# Altium project RevvyPcbTester.PrjPcb
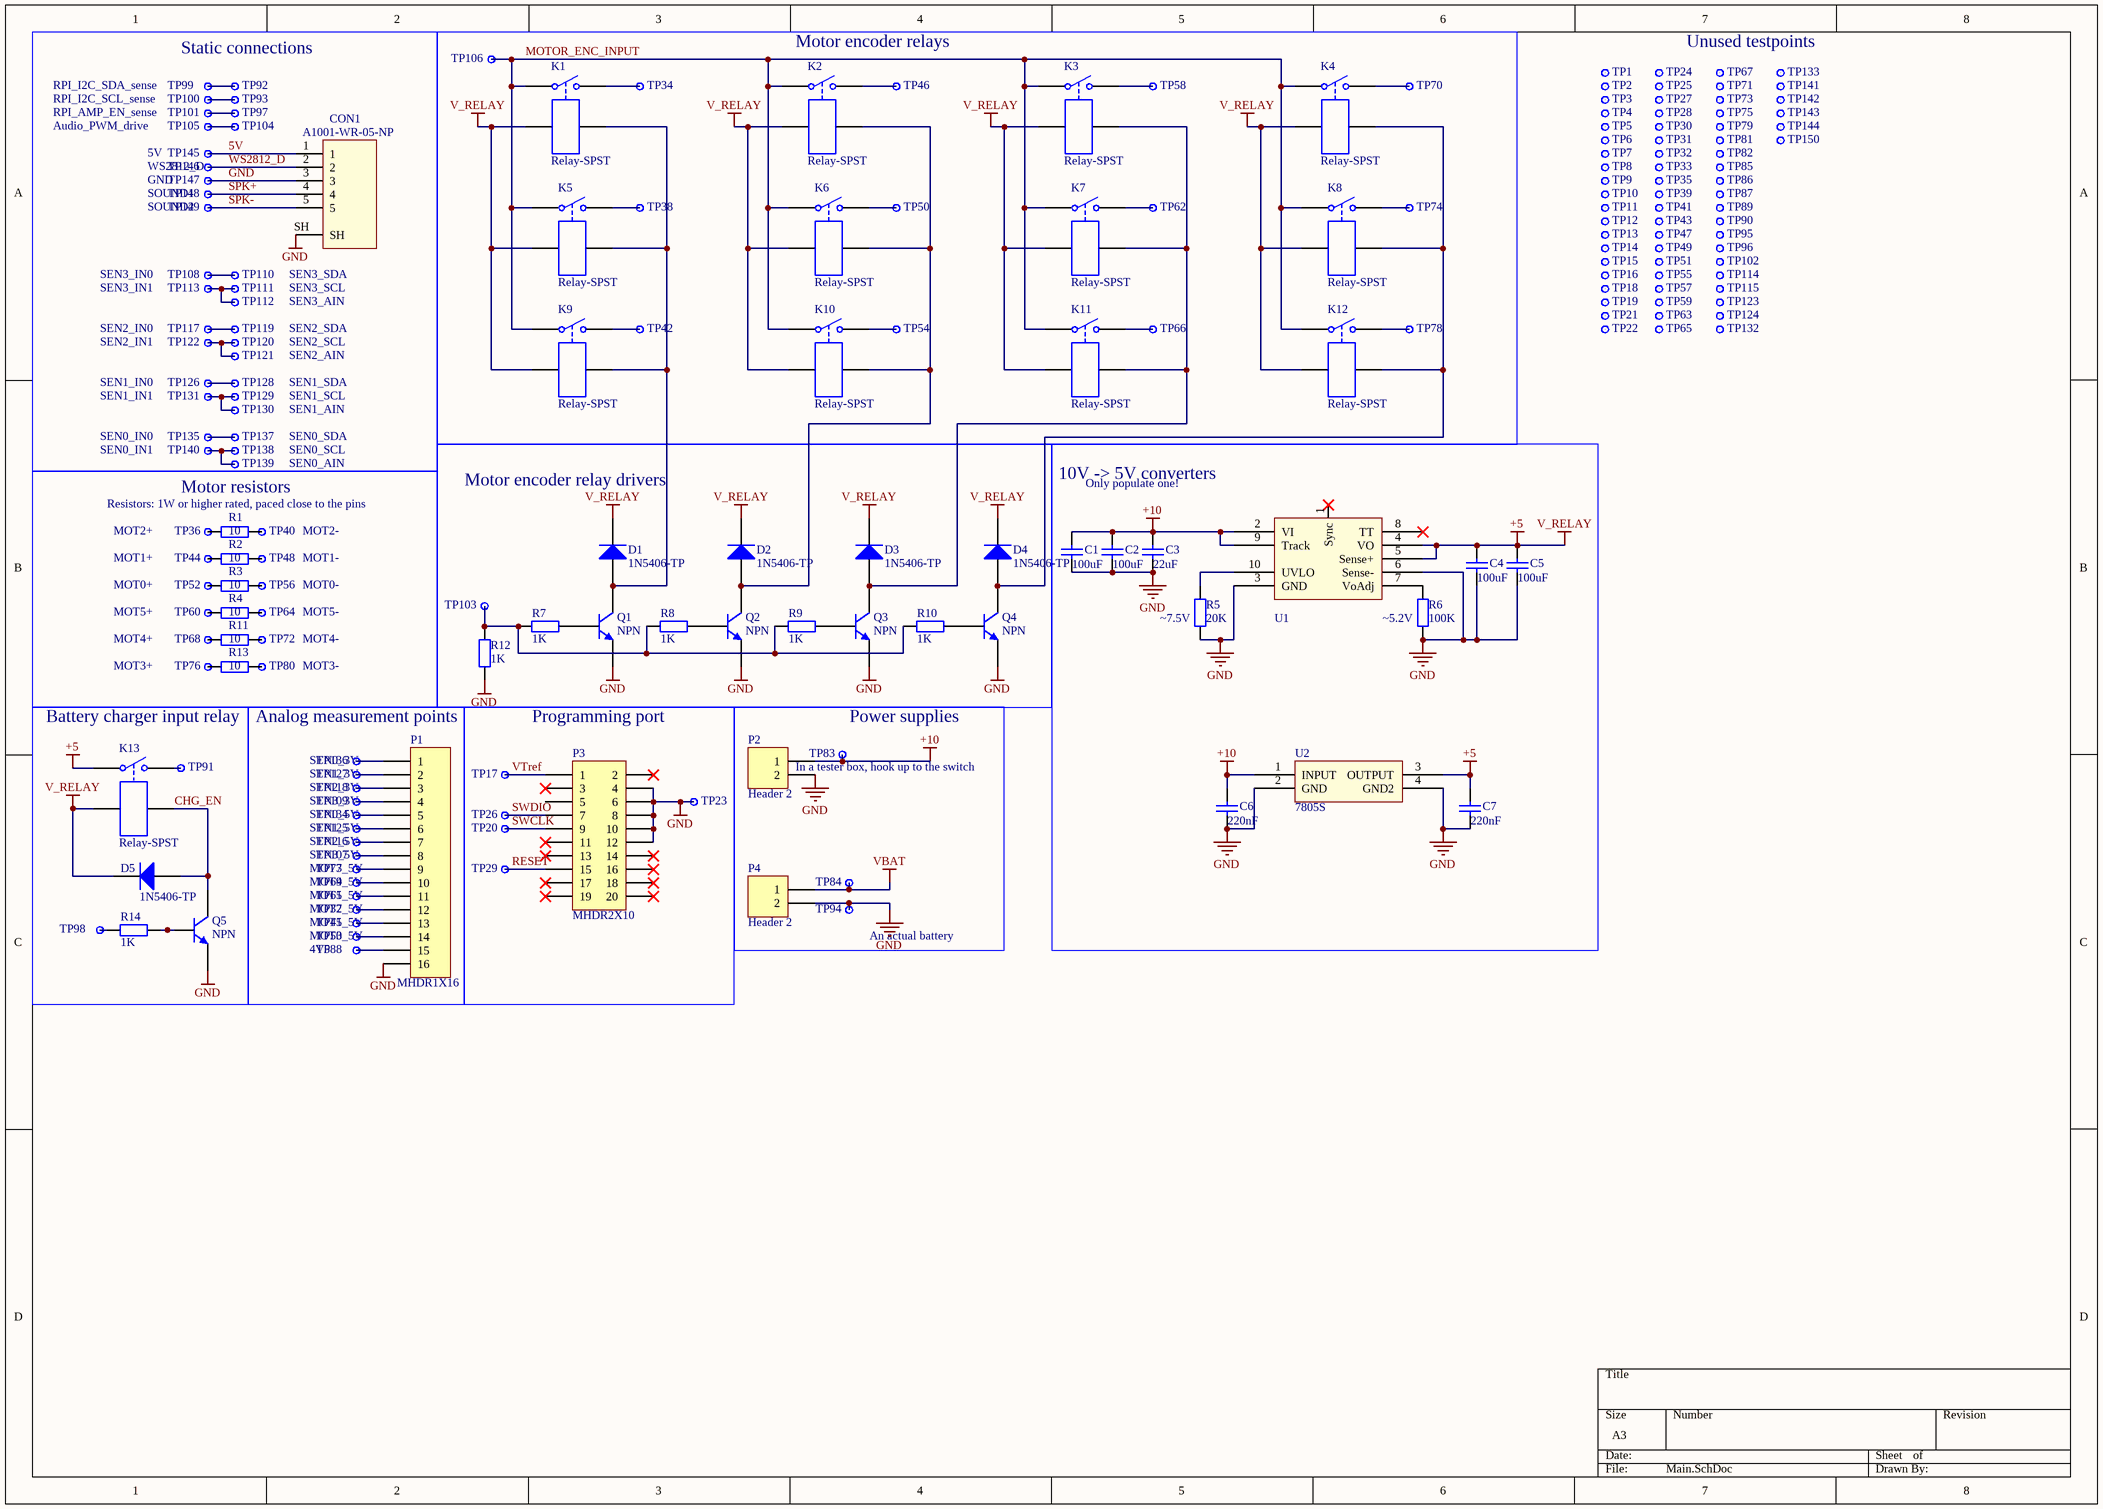
[diagram p0: Main.SchDoc]
1 sheet, 201 parts. Net scope: global (net labels, ports and power ports of the same name join across sheets).
Board file: Pcb.PcbDoc

## Sheet Main.SchDoc
size A3

### Parts
C1  value 100uF  [C3216]  (hidden comment: CL31A107MPKNNWE)
C2  value 100uF  [C3216]  (hidden comment: CL31A107MPKNNWE)
C3  value 22uF  [6-0805_N]  (hidden comment: Cap)
C4  value 100uF  [C3216]  (hidden comment: CL31A107MPKNNWE)
C5  value 100uF  [C3216]  (hidden comment: CL31A107MPKNNWE)
C6  value 220nF  [6-0805_N]  (hidden comment: Cap)
C7  value 220nF  [6-0805_N]  (hidden comment: Cap)
CON1  A1001-WR-05-NP  [LED molex]
D1  1N5406-TP  [DO-201AD]
D2  1N5406-TP  [DO-201AD]
D3  1N5406-TP  [DO-201AD]
D4  1N5406-TP  [DO-201AD]
D5  1N5406-TP  [DO-201AD]
K1  Relay-SPST  [AHQSH105LM100G]
K2  Relay-SPST  [AHQSH105LM100G]
K3  Relay-SPST  [AHQSH105LM100G]
K4  Relay-SPST  [AHQSH105LM100G]
K5  Relay-SPST  [AHQSH105LM100G]
K6  Relay-SPST  [AHQSH105LM100G]
K7  Relay-SPST  [AHQSH105LM100G]
K8  Relay-SPST  [AHQSH105LM100G]
K9  Relay-SPST  [AHQSH105LM100G]
K10  Relay-SPST  [AHQSH105LM100G]
K11  Relay-SPST  [AHQSH105LM100G]
K12  Relay-SPST  [AHQSH105LM100G]
K13  Relay-SPST  [AHQSH105LM100G]
P1  MHDR1X16  [MHDR1X16]
P2  Header 2  [HDR1X2]
P3  MHDR2X10  [MHDR2X10]
P4  Header 2  [HDR1X2]
Q1  NPN  [SOT-23_N]
Q2  NPN  [SOT-23_N]
Q3  NPN  [SOT-23_N]
Q4  NPN  [SOT-23_N]
Q5  NPN  [SOT-23_N]
R1  value 10  [AXIAL-0.7]  (hidden comment: Res2)
R2  value 10  [AXIAL-0.7]  (hidden comment: Res2)
R3  value 10  [AXIAL-0.7]  (hidden comment: Res2)
R4  value 10  [AXIAL-0.7]  (hidden comment: Res2)
R5  value 20K  [1608[0603]]  (hidden comment: Res2)
R6  value 100K  [1608[0603]]  (hidden comment: Res2)
R7  value 1K  [1608[0603]]  (hidden comment: Res2)
R8  value 1K  [1608[0603]]  (hidden comment: Res2)
R9  value 1K  [1608[0603]]  (hidden comment: Res2)
R10  value 1K  [1608[0603]]  (hidden comment: Res2)
R11  value 10  [AXIAL-0.7]  (hidden comment: Res2)
R12  value 1K  [1608[0603]]  (hidden comment: Res2)
R13  value 10  [AXIAL-0.7]  (hidden comment: Res2)
R14  value 1K  [1608[0603]]  (hidden comment: Res2)
TP1  Pin  [Pin]  (value not drawn)
TP2  Pin  [Pin]  (value not drawn)
TP3  Pin  [Pin]  (value not drawn)
TP4  Pin  [Pin]  (value not drawn)
TP5  Pin  [Pin]  (value not drawn)
TP6  Pin  [Pin]  (value not drawn)
TP7  Pin  [Pin]  (value not drawn)
TP8  Pin  [Pin]  (value not drawn)
TP9  Pin  [Pin]  (value not drawn)
TP10  Pin  [Pin]  (value not drawn)
TP11  Pin  [Pin]  (value not drawn)
TP12  Pin  [Pin]  (value not drawn)
TP13  Pin  [Pin]  (value not drawn)
TP14  Pin  [Pin]  (value not drawn)
TP15  Pin  [Pin]  (value not drawn)
TP16  Pin  [Pin]  (value not drawn)
TP17  Pin  [Pin]  (value not drawn)
TP18  Pin  [Pin]  (value not drawn)
TP19  Pin  [Pin]  (value not drawn)
TP20  Pin  [Pin]  (value not drawn)
TP21  Pin  [Pin]  (value not drawn)
TP22  Pin  [Pin]  (value not drawn)
TP23  Pin  [Pin]  (value not drawn)
TP24  Pin  [Pin]  (value not drawn)
TP25  Pin  [Pin]  (value not drawn)
TP26  Pin  [Pin]  (value not drawn)
TP27  Pin  [Pin]  (value not drawn)
TP28  Pin  [Pin]  (value not drawn)
TP29  Pin  [Pin]  (value not drawn)
TP30  Pin  [Pin]  (value not drawn)
TP31  Pin  [Pin]  (value not drawn)
TP32  Pin  [Pin]  (value not drawn)
TP33  Pin  [Pin]  (value not drawn)
TP34  Pin  [Pin]  (value not drawn)
TP35  Pin  [Pin]  (value not drawn)
TP36  Pin  [Pin]  (value not drawn)
TP37  Pin  [Pin]  (value not drawn)
TP38  Pin  [Pin]  (value not drawn)
TP39  Pin  [Pin]  (value not drawn)
TP40  Pin  [Pin]  (value not drawn)
TP41  Pin  [Pin]  (value not drawn)
TP42  Pin  [Pin]  (value not drawn)
TP43  Pin  [Pin]  (value not drawn)
TP44  Pin  [Pin]  (value not drawn)
TP45  Pin  [Pin]  (value not drawn)
TP46  Pin  [Pin]  (value not drawn)
TP47  Pin  [Pin]  (value not drawn)
TP48  Pin  [Pin]  (value not drawn)
TP49  Pin  [Pin]  (value not drawn)
TP50  Pin  [Pin]  (value not drawn)
TP51  Pin  [Pin]  (value not drawn)
TP52  Pin  [Pin]  (value not drawn)
TP53  Pin  [Pin]  (value not drawn)
TP54  Pin  [Pin]  (value not drawn)
TP55  Pin  [Pin]  (value not drawn)
TP56  Pin  [Pin]  (value not drawn)
TP57  Pin  [Pin]  (value not drawn)
TP58  Pin  [Pin]  (value not drawn)
TP59  Pin  [Pin]  (value not drawn)
TP60  Pin  [Pin]  (value not drawn)
TP61  Pin  [Pin]  (value not drawn)
TP62  Pin  [Pin]  (value not drawn)
TP63  Pin  [Pin]  (value not drawn)
TP64  Pin  [Pin]  (value not drawn)
TP65  Pin  [Pin]  (value not drawn)
TP66  Pin  [Pin]  (value not drawn)
TP67  Pin  [Pin]  (value not drawn)
TP68  Pin  [Pin]  (value not drawn)
TP69  Pin  [Pin]  (value not drawn)
TP70  Pin  [Pin]  (value not drawn)
TP71  Pin  [Pin]  (value not drawn)
TP72  Pin  [Pin]  (value not drawn)
TP73  Pin  [Pin]  (value not drawn)
TP74  Pin  [Pin]  (value not drawn)
TP75  Pin  [Pin]  (value not drawn)
TP76  Pin  [Pin]  (value not drawn)
TP77  Pin  [Pin]  (value not drawn)
TP78  Pin  [Pin]  (value not drawn)
TP79  Pin  [Pin]  (value not drawn)
TP80  Pin  [Pin]  (value not drawn)
TP81  Pin  [Pin]  (value not drawn)
TP82  Pin  [Pin]  (value not drawn)
TP83  Pin  [Pin]  (value not drawn)
TP84  Pin  [Pin]  (value not drawn)
TP85  Pin  [Pin]  (value not drawn)
TP86  Pin  [Pin]  (value not drawn)
TP87  Pin  [Pin]  (value not drawn)
TP88  Pin  [Pin]  (value not drawn)
TP89  Pin  [Pin]  (value not drawn)
TP90  Pin  [Pin]  (value not drawn)
TP91  Pin  [Pin]  (value not drawn)
TP92  Pin  [Pin]  (value not drawn)
TP93  Pin  [Pin]  (value not drawn)
TP94  Pin  [Pin]  (value not drawn)
TP95  Pin  [Pin]  (value not drawn)
TP96  Pin  [Pin]  (value not drawn)
TP97  Pin  [Pin]  (value not drawn)
TP98  Pin  [Pin]  (value not drawn)
TP99  Pin  [Pin]  (value not drawn)
TP100  Pin  [Pin]  (value not drawn)
TP101  Pin  [Pin]  (value not drawn)
TP102  Pin  [Pin]  (value not drawn)
TP103  Pin  [Pin]  (value not drawn)
TP104  Pin  [Pin]  (value not drawn)
TP105  Pin  [Pin]  (value not drawn)
TP106  Pin  [Pin]  (value not drawn)
TP107  Pin  [Pin]  (value not drawn)
TP108  Pin  [Pin]  (value not drawn)
TP109  Pin  [Pin]  (value not drawn)
TP110  Pin  [Pin]  (value not drawn)
TP111  Pin  [Pin]  (value not drawn)
TP112  Pin  [Pin]  (value not drawn)
TP113  Pin  [Pin]  (value not drawn)
TP114  Pin  [Pin]  (value not drawn)
TP115  Pin  [Pin]  (value not drawn)
TP116  Pin  [Pin]  (value not drawn)
TP117  Pin  [Pin]  (value not drawn)
TP118  Pin  [Pin]  (value not drawn)
TP119  Pin  [Pin]  (value not drawn)
TP120  Pin  [Pin]  (value not drawn)
TP121  Pin  [Pin]  (value not drawn)
TP122  Pin  [Pin]  (value not drawn)
TP123  Pin  [Pin]  (value not drawn)
TP124  Pin  [Pin]  (value not drawn)
TP125  Pin  [Pin]  (value not drawn)
TP126  Pin  [Pin]  (value not drawn)
TP127  Pin  [Pin]  (value not drawn)
TP128  Pin  [Pin]  (value not drawn)
TP129  Pin  [Pin]  (value not drawn)
TP130  Pin  [Pin]  (value not drawn)
TP131  Pin  [Pin]  (value not drawn)
TP132  Pin  [Pin]  (value not drawn)
TP133  Pin  [Pin]  (value not drawn)
TP134  Pin  [Pin]  (value not drawn)
TP135  Pin  [Pin]  (value not drawn)
TP136  Pin  [Pin]  (value not drawn)
TP137  Pin  [Pin]  (value not drawn)
TP138  Pin  [Pin]  (value not drawn)
TP139  Pin  [Pin]  (value not drawn)
TP140  Pin  [Pin]  (value not drawn)
TP141  Pin  [Pin]  (value not drawn)
TP142  Pin  [Pin]  (value not drawn)
TP143  Pin  [Pin]  (value not drawn)
TP144  Pin  [Pin]  (value not drawn)
TP145  Pin  [Pin]  (value not drawn)
TP146  Pin  [Pin]  (value not drawn)
TP147  Pin  [Pin]  (value not drawn)
TP148  Pin  [Pin]  (value not drawn)
TP149  Pin  [Pin]  (value not drawn)
TP150  Pin  [Pin]  (value not drawn)
U1  PTH08T231W  [PTH08T231W]  (value not drawn)
U2  7805S  [TO-263-3]

### Blocks framed on the sheet
Static connections: CON1 TP92 TP93 TP97 TP99-TP101 TP104 TP105 TP108 TP110-TP113 TP117 TP119-TP122 TP126 TP128-TP131 TP135 TP137-TP140 TP145-TP149
Motor encoder relays: K1-K12 TP34 TP38 TP42 TP46 TP50 TP54 TP58 TP62 TP66 TP70 TP74 TP78 TP106
Motor encoder relay drivers: D1-D4 Q1-Q4 R7-R10 R12 TP103
10V -> 5V converters: C1-C7 R5 R6 U1 U2
Motor resistors: R1-R4 R11 R13 TP36 TP40 TP44 TP48 TP52 TP56 TP60 TP64 TP68 TP72 TP76 TP80
Battery charger input relay: D5 K13 Q5 R14 TP91 TP98
Analog measurement points: P1 TP37 TP45 TP53 TP61 TP69 TP77 TP88 TP107 TP109 TP116 TP118 TP125 TP127 TP134 TP136
Programming port: P3 TP17 TP20 TP23 TP26 TP29
Power supplies: P2 P4 TP83 TP84 TP94

### Nets
+5: C4.2 C5.2 C7.2 D1.2(K) D2.2(K) D3.2(K) D4.2(K) D5.2(K) K1.3 K2.3 K3.3 K4.3 K5.3 K6.3 K7.3 K8.3 K9.3 K10.3 K11.3 K12.3 K13.1 K13.3 U1.4(VO) U1.5(Sense+) U2.3(OUTPUT)  [also labelled V_RELAY]
+10: C1.2 C2.2 C3.2 C6.2 P2.1 TP83.1(Pin) U1.2(VI) U1.9(Track) U2.1(INPUT)
GND: C1.1 C2.1 C3.1 C4.1 C5.1 C6.1 C7.1 CON1.3 CON1.SH P1.16 P2.2 P3.4 P3.6 P3.8 P3.10 P3.12 P4.2 Q1.2(E) Q2.2(E) Q3.2(E) Q4.2(E) Q5.2(E) R5.1 R6.1 R12.1 TP23.1(Pin) TP94.1(Pin) TP147.1(Pin) U1.3(GND) U1.6(Sense-) U2.2(GND) U2.4(GND2)
VBAT: P4.1 TP84.1(Pin)
5V: CON1.1 TP145.1(Pin)
CHG_EN: D5.1(A) K13.4 Q5.3(C)
MOTOR_ENC_INPUT: K1.1 K2.1 K3.1 K4.1 K5.1 K6.1 K7.1 K8.1 K9.1 K10.1 K11.1 K12.1 TP106.1(Pin)
RESET: P3.15 TP29.1(Pin)
SPK+: CON1.4 TP148.1(Pin)
SPK-: CON1.5 TP149.1(Pin)
SWCLK: P3.9 TP20.1(Pin)
SWDIO: P3.7 TP26.1(Pin)
VTref: P3.1 TP17.1(Pin)
WS2812_D: CON1.2 TP146.1(Pin)
NetD1_1: D1.1(A) K1.4 K5.4 K9.4 Q1.3(C)
NetD2_1: D2.1(A) K2.4 K6.4 K10.4 Q2.3(C)
NetD3_1: D3.1(A) K3.4 K7.4 K11.4 Q3.3(C)
NetD4_1: D4.1(A) K4.4 K8.4 K12.4 Q4.3(C)
NetK1_2: K1.2 TP34.1(Pin)
NetK2_2: K2.2 TP46.1(Pin)
NetK3_2: K3.2 TP58.1(Pin)
NetK4_2: K4.2 TP70.1(Pin)
NetK5_2: K5.2 TP38.1(Pin)
NetK6_2: K6.2 TP50.1(Pin)
NetK7_2: K7.2 TP62.1(Pin)
NetK8_2: K8.2 TP74.1(Pin)
NetK9_2: K9.2 TP42.1(Pin)
NetK10_2: K10.2 TP54.1(Pin)
NetK11_2: K11.2 TP66.1(Pin)
NetK12_2: K12.2 TP78.1(Pin)
NetK13_2: K13.2 TP91.1(Pin)
NetP1_1: P1.1 TP136.1(Pin)
NetP1_2: P1.2 TP127.1(Pin)
NetP1_3: P1.3 TP118.1(Pin)
NetP1_4: P1.4 TP109.1(Pin)
NetP1_5: P1.5 TP134.1(Pin)
NetP1_6: P1.6 TP125.1(Pin)
NetP1_7: P1.7 TP116.1(Pin)
NetP1_8: P1.8 TP107.1(Pin)
NetP1_9: P1.9 TP77.1(Pin)
NetP1_10: P1.10 TP69.1(Pin)
NetP1_11: P1.11 TP61.1(Pin)
NetP1_12: P1.12 TP37.1(Pin)
NetP1_13: P1.13 TP45.1(Pin)
NetP1_14: P1.14 TP53.1(Pin)
NetP1_15: P1.15 TP88.1(Pin)
NetQ1_1: Q1.1(B) R7.2
NetQ2_1: Q2.1(B) R8.2
NetQ3_1: Q3.1(B) R9.2
NetQ4_1: Q4.1(B) R10.2
NetQ5_1: Q5.1(B) R14.2
NetR1_1: R1.1 TP36.1(Pin)
NetR1_2: R1.2 TP40.1(Pin)
NetR2_1: R2.1 TP44.1(Pin)
NetR2_2: R2.2 TP48.1(Pin)
NetR3_1: R3.1 TP52.1(Pin)
NetR3_2: R3.2 TP56.1(Pin)
NetR4_1: R4.1 TP60.1(Pin)
NetR4_2: R4.2 TP64.1(Pin)
NetR5_2: R5.2 U1.10(UVLO)
NetR6_2: R6.2 U1.7(VoAdj)
NetR7_1: R7.1 R8.1 R9.1 R10.1 R12.2 TP103.1(Pin)
NetR11_1: R11.1 TP68.1(Pin)
NetR11_2: R11.2 TP72.1(Pin)
NetR13_1: R13.1 TP76.1(Pin)
NetR13_2: R13.2 TP80.1(Pin)
NetR14_1: R14.1 TP98.1(Pin)
NetTP92_1: TP92.1(Pin) TP99.1(Pin)
NetTP93_1: TP93.1(Pin) TP100.1(Pin)
NetTP97_1: TP97.1(Pin) TP101.1(Pin)
NetTP104_1: TP104.1(Pin) TP105.1(Pin)
NetTP108_1: TP108.1(Pin) TP110.1(Pin)
NetTP111_1: TP111.1(Pin) TP112.1(Pin) TP113.1(Pin)
NetTP117_1: TP117.1(Pin) TP119.1(Pin)
NetTP120_1: TP120.1(Pin) TP121.1(Pin) TP122.1(Pin)
NetTP126_1: TP126.1(Pin) TP128.1(Pin)
NetTP129_1: TP129.1(Pin) TP130.1(Pin) TP131.1(Pin)
NetTP135_1: TP135.1(Pin) TP137.1(Pin)
NetTP138_1: TP138.1(Pin) TP139.1(Pin) TP140.1(Pin)

Not connected (* = marked no-connect by the designer): P3 2* 3* 5 11* 13* 14* 16* 17* 18* 19* 20*; TP1 1(Pin); TP2 1(Pin); TP3 1(Pin); TP4 1(Pin); TP5 1(Pin); TP6 1(Pin); TP7 1(Pin); TP8 1(Pin); TP9 1(Pin); TP10 1(Pin); TP11 1(Pin); TP12 1(Pin); TP13 1(Pin); TP14 1(Pin); TP15 1(Pin); TP16 1(Pin); TP18 1(Pin); TP19 1(Pin); TP21 1(Pin); TP22 1(Pin); TP24 1(Pin); TP25 1(Pin); TP27 1(Pin); TP28 1(Pin); TP30 1(Pin); TP31 1(Pin); TP32 1(Pin); TP33 1(Pin); TP35 1(Pin); TP39 1(Pin); TP41 1(Pin); TP43 1(Pin); TP47 1(Pin); TP49 1(Pin); TP51 1(Pin); TP55 1(Pin); TP57 1(Pin); TP59 1(Pin); TP63 1(Pin); TP65 1(Pin); TP67 1(Pin); TP71 1(Pin); TP73 1(Pin); TP75 1(Pin); TP79 1(Pin); TP81 1(Pin); TP82 1(Pin); TP85 1(Pin); TP86 1(Pin); TP87 1(Pin); TP89 1(Pin); TP90 1(Pin); TP95 1(Pin); TP96 1(Pin); TP102 1(Pin); TP114 1(Pin); TP115 1(Pin); TP123 1(Pin); TP124 1(Pin); TP132 1(Pin); TP133 1(Pin); TP141 1(Pin); TP142 1(Pin); TP143 1(Pin); TP144 1(Pin); TP150 1(Pin); U1 1(Sync)* 8(TT)*

### Notes on the sheet
- Unused testpoints
- RPI_I2C_SDA_sense
- RPI_I2C_SCL_sense
- RPI_AMP_EN_sense
- Audio_PWM_drive
- 5V
- WS2812_D
- GND
- SOUND1
- SOUND2
- SEN3_IN0
- SEN3_IN1
- SEN3_SDA
- SEN3_SCL
- SEN3_AIN
- SEN2_IN0
- SEN2_IN1
- SEN2_SDA
- SEN2_SCL
- SEN2_AIN
- SEN1_IN0
- SEN1_IN1
- SEN0_IN0
- SEN0_IN1
- SEN1_SDA
- SEN1_SCL
- SEN1_AIN
- SEN0_SDA
- SEN0_SCL
- Resistors: 1W or higher rated, paced close to the pins
- SEN0_AIN
- Only populate one!
- MOT2+
- MOT1+
- MOT0+
- MOT2-
- MOT1-
- MOT0-
- MOT5+
- MOT4+
- MOT5-
- MOT4-
- (near R5) ~7.5V
- (near R6) ~5.2V
- MOT3+
- MOT3-
- SEN1_3V
- SEN0_3V
- In a tester box, hook up to the switch
- SEN3_3V
- SEN2_3V
- SEN3_5V
- SEN2_5V
- SEN1_5V
- SEN0_5V
- MOT2_5V
- MOT5_5V
- MOT4_5V
- MOT3_5V
- 4V5
- MOT1_5V
- MOT0_5V
- An actual battery

### Library data of the parts
C1-C7 = Cap: Capacitor; Published: 8-Jun-2000; LatestRevisionDate: 17-Jul-2002; LatestRevisionNote: Re-released for DXP Platform.; PackageReference: RAD-0.3; Publisher: Altium Limited; PackageDescription: Radial Cap, Thru-Hole; 2 Leads; 0.3 in Pin Spacing
  C1 C2 C4 C5: PartNumber: CL31A107MPKNNWE
CON1 = LED molex: PartNumber: A1001-WR-05-NP
D1-D5 = Diode: Published: 8-Jun-2000; LatestRevisionDate: 17-Jul-2002; LatestRevisionNote: Re-released for DXP Platform.; PackageVersion: Sep-1996; PackageReference: SMC; Publisher: Altium Limited; PackageDescription: DO-214-AB/SMC; 2 C-Bend Leads; Body 7.9 x 5.9 mm, inc. leads (LxW); Code_JEDEC: DO-214-AB; PartNumber: 1N5406-TP
K1-K13 = Relay-SPST: Single-Pole Single-Throw Relay; Published: 24-Mar-1999; LatestRevisionDate: 17-Jul-2002; LatestRevisionNote: Re-released for DXP Platform.; PackageReference: MODULE4; Publisher: Altium Limited
P1 = MHDR1X16: Header, 16-Pin; LatestRevisionDate: 17-Jul-2002; LatestRevisionNote: Re-released for DXP Platform.; Publisher: Altium Limited
P2 P4 = Header 2: Header, 2-Pin; LatestRevisionDate: 17-Jul-2002; LatestRevisionNote: Re-released for DXP Platform.; Publisher: Altium Limited
P3 = MHDR2X10: Header, 10-Pin, Dual row; LatestRevisionDate: 17-Jul-2002; LatestRevisionNote: Re-released for DXP Platform.; Publisher: Altium Limited
Q1-Q5 = NPN: NPN Bipolar Transistor MMBT2222A; Published: 8-Jun-2000; LatestRevisionDate: 17-Jul-2002; LatestRevisionNote: Re-released for DXP Platform.; PackageReference: TO-226-AA; Publisher: Altium Limited; PackageDescription: TO, Flat Index; 3 In-Line, Axial Leads; Body Dia. 4.8mm; Leads 0.55 x 0.51 mm (max); Code_JEDEC: TO-226-AA; Part Number: MMBT2222A
R1-R4 R11 R13 = Res2: Resistor EP5WS10RJ 10R 5W; Published: 8-Jun-2000; LatestRevisionDate: 17-Jul-2002; LatestRevisionNote: Re-released for DXP Platform.; PackageReference: AXIAL-0.4; Publisher: Altium Limited; PackageDescription: Axial Device, Thru-Hole; 2 Leads; 0.4 in Pin Spacing; PartNumber: EP5WS10RJ
R5-R10 R12 R14 = Res2: Resistor; Published: 8-Jun-2000; LatestRevisionDate: 17-Jul-2002; LatestRevisionNote: Re-released for DXP Platform.; PackageReference: AXIAL-0.4; Publisher: Altium Limited; PackageDescription: Axial Device, Thru-Hole; 2 Leads; 0.4 in Pin Spacing
TP1-TP150 = Pin: Testing pin